# Altium schematic sheet Sch.SchDoc
size A4
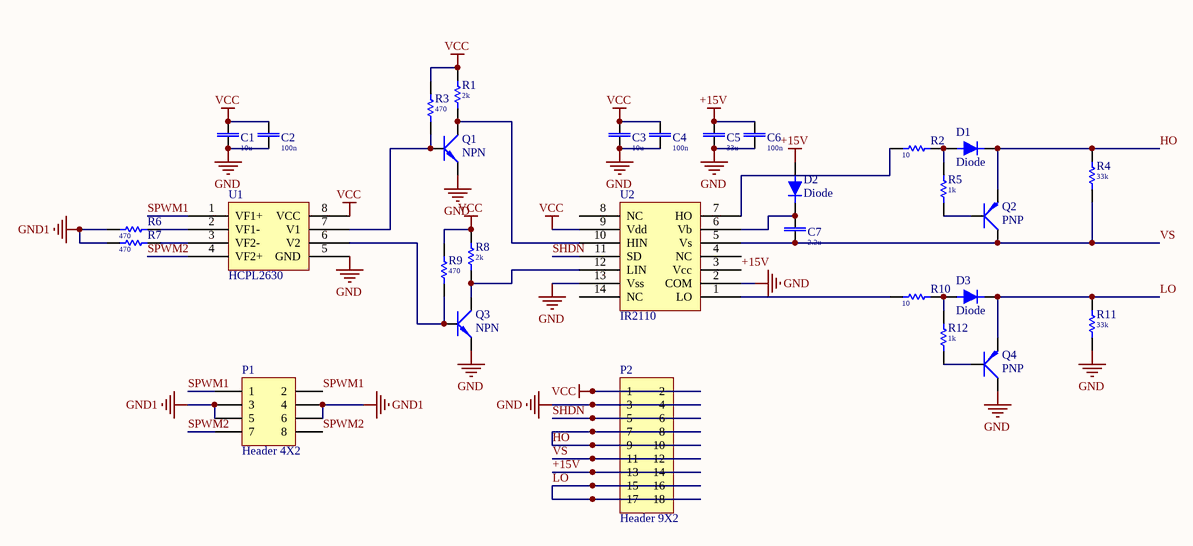
[diagram p0: Sch.SchDoc]

## Parts
C1  value 10u  [CAP0805]  (hidden comment: Cap)
C2  value 100n  [CAP0603]  (hidden comment: Cap)
C3  value 10u  [CAP0805]  (hidden comment: Cap)
C4  value 100n  [CAP0603]  (hidden comment: Cap)
C5  value 33u  [CAP 2.5*5*11]  (hidden comment: Cap)
C6  value 100n  [CAP0603]  (hidden comment: Cap)
C7  value 2.2u  [CAP0805]  (hidden comment: Cap)
D1  Diode  [DIODE_SMA]
D2  Diode  [DIODE_SMA]
D3  Diode  [DIODE_SMA]
P1  Header 4X2  [HDR2X4]
P2  Header 9X2  [HDR2X9]
Q1  NPN  [BJT]
Q2  PNP  [BJT]
Q3  NPN  [BJT]
Q4  PNP  [BJT]
R1  2k  [RES0603]
R2  10  [RES0603]
R3  470  [RES0603]
R4  33k  [RES0603]
R5  1k  [RES0603]
R6  470  [RES0603]
R7  470  [RES0603]
R8  2k  [RES0603]
R9  470  [RES0603]
R10  10  [RES0603]
R11  33k  [RES0603]
R12  1k  [RES0603]
U1  HCPL2630  [DIP-8]
U2  IR2110  [DIP-14]

## Nets
+15V: C5.1 C6.1 D2.1(A) P2.13 P2.14 U2.3(Vcc)
GND: C1.2 C2.2 C3.2 C4.2 C5.2 C6.2 P2.3 P2.4 Q1.3(E) Q3.3(E) Q4.1(C) R11.2 U1.5(GND) U2.2(COM) U2.13(Vss)
GND1: P1.3 P1.4 P1.5 P1.6 R6.1 R7.1
VCC: C1.1 C2.1 C3.1 C4.1 P2.1 P2.2 R1.2 R3.1 R8.2 R9.1 U1.8(VCC) U2.9(Vdd)
HO: D1.2(K) P2.7 P2.8 P2.9 P2.10 Q2.3(E) R4.1
LO: D3.2(K) P2.15 P2.16 P2.17 P2.18 Q4.3(E) R11.1
SHDN: P2.5 P2.6 U2.11(SD)
SPWM1: P1.1 P1.2 U1.1(VF1+)
SPWM2: P1.7 P1.8 U1.4(VF2+)
VS: C7.2 P2.11 P2.12 Q2.1(C) R4.2 U2.5(Vs)
NetC7_1: C7.1 D2.2(K) U2.6(Vb)
NetD1_1: D1.1(A) R2.1 R5.1
NetD3_1: D3.1(A) R10.1 R12.1
NetQ1_1: Q1.1(C) R1.1 U2.10(HIN)
NetQ1_2: Q1.2(B) R3.2 U1.7(V1)
NetQ2_2: Q2.2(B) R5.2
NetQ3_1: Q3.1(C) R8.1 U2.12(LIN)
NetQ3_2: Q3.2(B) R9.2 U1.6(V2)
NetQ4_2: Q4.2(B) R12.2
NetR2_2: R2.2 U2.7(HO)
NetR6_2: R6.2 U1.2(VF1-)
NetR7_2: R7.2 U1.3(VF2-)
NetR10_2: R10.2 U2.1(LO)

Not connected (* = marked no-connect by the designer): U2 4(NC) 8(NC) 14(NC)

## Library data of the parts
C1-C7 = Cap: Capacitor; Published: 8-Jun-2000; LatestRevisionDate: 17-Jul-2002; LatestRevisionNote: Re-released for DXP Platform.; PackageReference: RAD-0.3; Publisher: Altium Limited
D1-D3 = Diode: Default Diode; Published: 8-Jun-2000; LatestRevisionDate: 17-Jul-2002; LatestRevisionNote: Re-released for DXP Platform.; PackageVersion: Sep-1996; PackageReference: SMC; Publisher: Altium Limited; Code_JEDEC: DO-214-AB
P1 = Header 4X2: Header, 4-Pin, Dual row; LatestRevisionDate: 17-Jul-2002; LatestRevisionNote: Re-released for DXP Platform.; Publisher: Altium Limited
P2 = Header 9X2: Header, 9-Pin, Dual row; LatestRevisionDate: 17-Jul-2002; LatestRevisionNote: Re-released for DXP Platform.; Publisher: Altium Limited
Q1 Q3 = NPN: NPN Bipolar Transistor; Published: 8-Jun-2000; LatestRevisionDate: 17-Jul-2002; LatestRevisionNote: Re-released for DXP Platform.; PackageReference: TO-226; Publisher: Altium Limited; Code_JEDEC: TO-226-AA
Q2 Q4 = PNP: PNP Bipolar Transistor; Published: 8-Jun-2000; LatestRevisionDate: 29-May-2009; LatestRevisionNote: IPC-7351 Footprint Added.; PackageVersion: Aug-1999; PackageReference: SOT-23B; Publisher: Altium Limited; PackageDescription: 3-Pin SOT-23 Package 0.95 mm Pitch, 2.4 mm Lead Span
R1-R12 = Res1: Resistor; Published: 8-Jun-2000; LatestRevisionDate: 17-Jul-2002; LatestRevisionNote: Re-released for DXP Platform.; PackageReference: AXIAL-0.3; Publisher: Altium Limited
  R1 R8: Value: 2k
  R2 R10: Value: 10
  R3 R6 R7 R9: Value: 470
  R4 R11: Value: 33k
  R5 R12: Value: 1k